# Altium schematic sheet main.SchDoc
size A3; Date: 2026-10-02
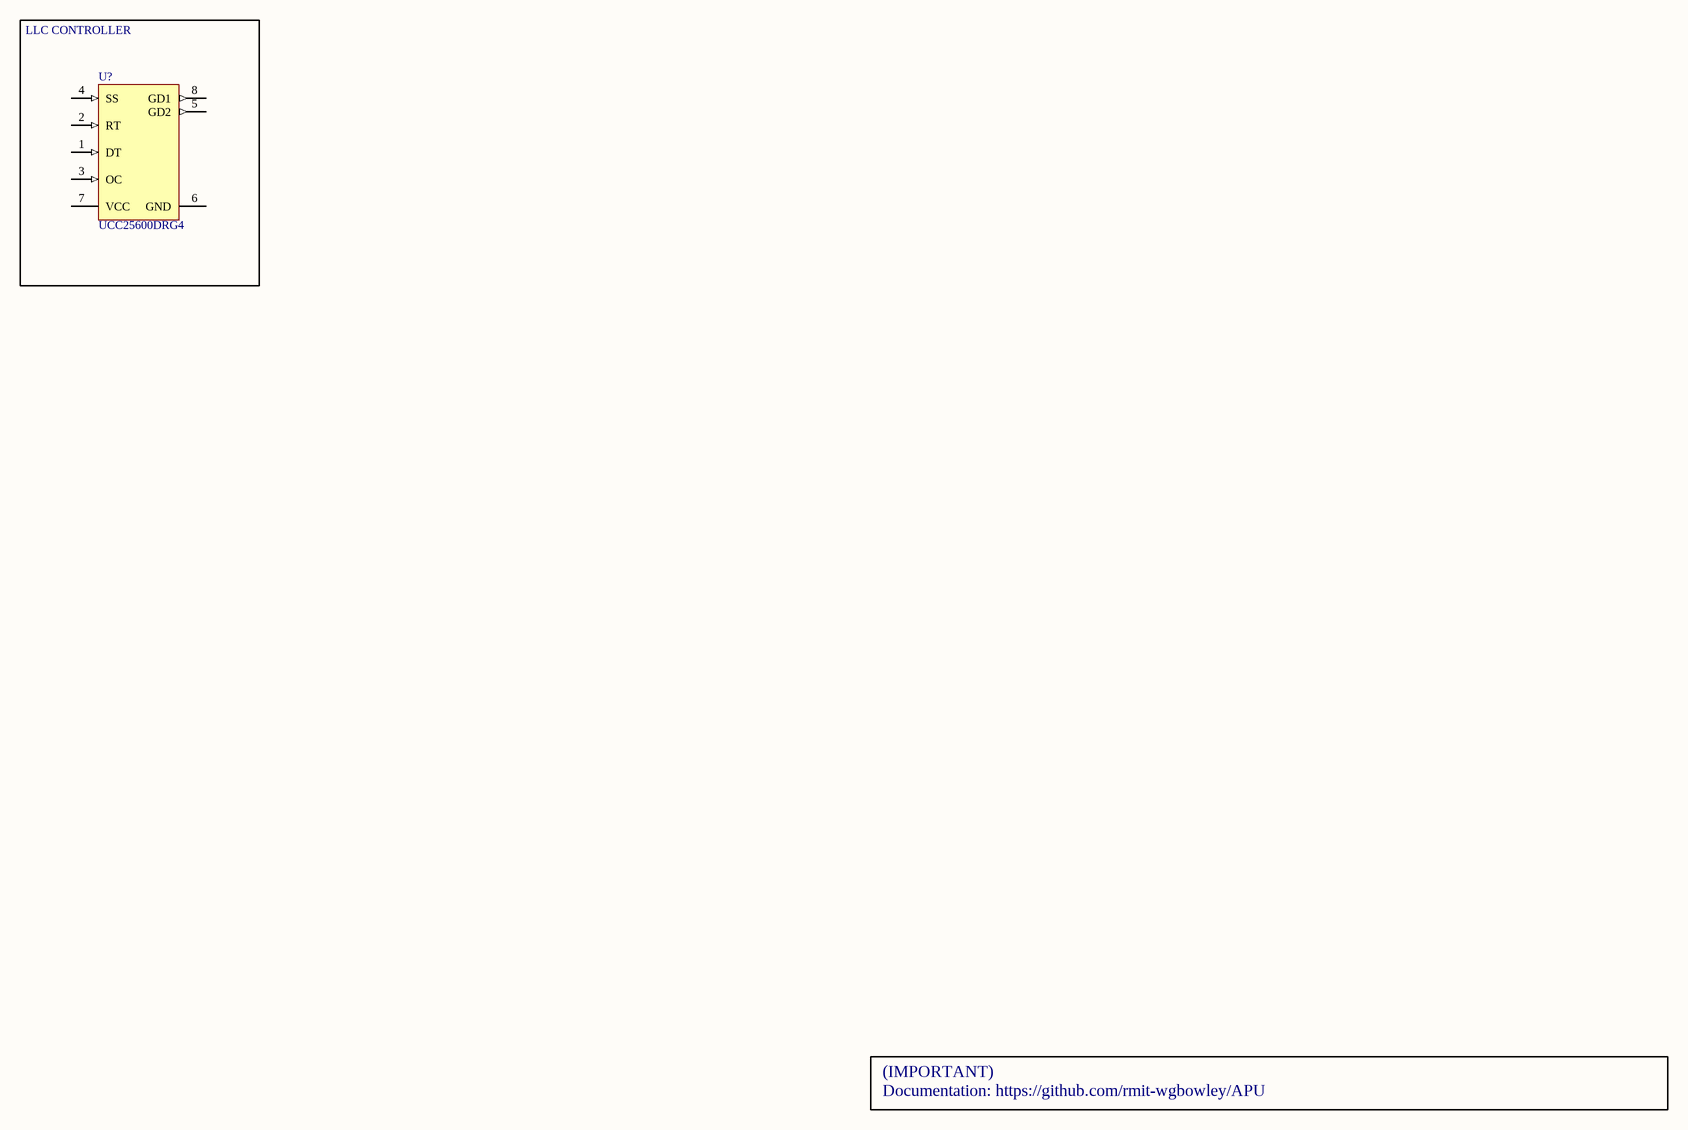
[diagram p0: main.SchDoc]

## Parts
U?  UCC25600DRG4  [D8_N]

## Blocks framed on the sheet
LLC CONTROLLER: U?

## Nets

Not connected (* = marked no-connect by the designer): U? 1(DT) 2(RT) 3(OC) 4(SS) 5(GD2) 6(GND) 7(VCC) 8(GD1)

## Notes on the sheet
- (IMPORTANT)
- Documentation: https://github.com/rmit-wgbowley/APU

## Library data of the parts
U? = CMP-0319-00891-1: High-Performance Resonant Mode Controller with Voltage Control, 50 % Duty Cycle, -40 to +125 degC, 8-pin SOIC (D), Green (RoHS & no Sb/Br); Manufacturer: Texas Instruments; UVLO Thresholds On/Off(V): 10.5/9.5; Frequency(Max)(kHz): 350; Duty Cycle(Max)(%): 50; Regulated Outputs(#): 2; Rating: Catalog; Topology: Resonant, Half-Bridge; SubFamily: PWM Controller; Mounting Technology: Surface Mount; PackageDescription: 8-Pin Plastic Small Outline Integrated Circuit, 4.9 x 3.9 mm, Pitch 1.27 mm Pitch; PartNumber: UCC25600DRG4; Code_JEDEC: MS-012AA; Control Method: Voltage; DatasheetVersion: SLUS846B; ComponentLink2URL: Samples URL:http://www.ti.com/lit/ds/symlink/ucc25600.pdf; Eco-Plan: Green (RoHS & no Sb/Br); ComponentLink1URL: http://www.ti.com/general/docs/lit/getliterature.tsp?genericPartNumber=UCC25600&fileType=pdf; PackageVersion: revM, Jun-2011; PackageReference: D8; ComponentLink1Description: Datasheet; ComponentLink2Description: URL Link1